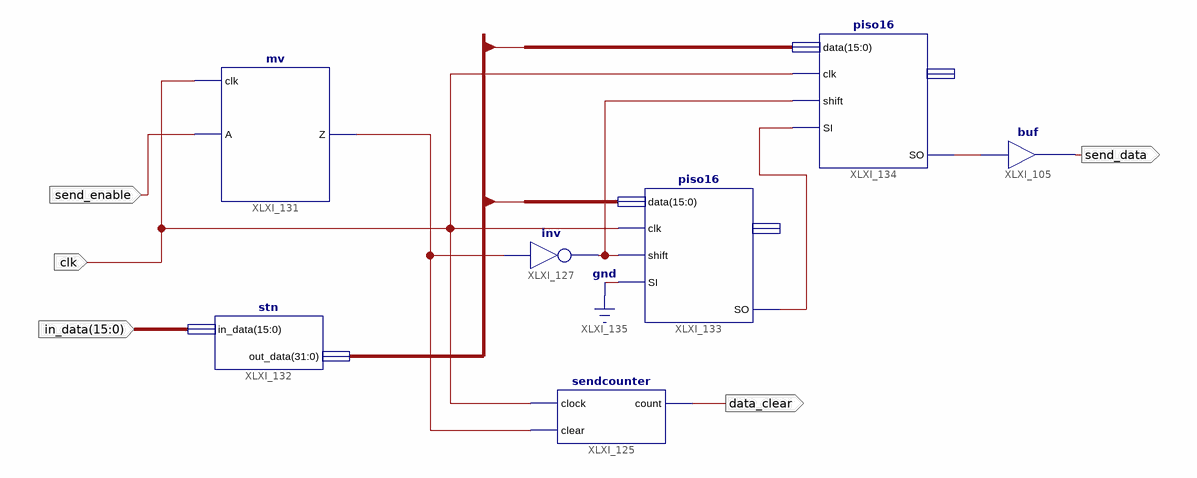
[diagram p0: schematic sheet 1]
// Xilinx ISE schematic sender.sch (spartan6) as structural Verilog: 7 symbols, 5 ports
module sender (
  input  clk,
  input  send_enable,
  input  [15:0] in_data,
  output data_clear,
  output send_data
);

  wire XLXN_331, XLXN_352, XLXN_361, XLXN_362;
  wire [31:0] stn_out;

  sendcounter XLXI_125 (.clock(clk), .clear(XLXN_331), .count(data_clear));
  not XLXI_127 (XLXN_352, XLXN_331);
  mv XLXI_131 (.clk(clk), .A(send_enable), .Z(XLXN_331));
  piso16 XLXI_134 (.SI(XLXN_361), .data(stn_out[31:16]), .clk(clk), .shift(XLXN_352), .SO(XLXN_362));  // open: data_out
  piso16 XLXI_133 (.SI(1'b0), .data(stn_out[15:0]), .clk(clk), .shift(XLXN_352), .SO(XLXN_361));  // open: data_out
  buf XLXI_105 (send_data, XLXN_362);
  stn XLXI_132 (.in_data(in_data), .out_data(stn_out));
endmodule
